# EAGLE board Educ-8 (EAGLE 6.6.0), part 1 of 4
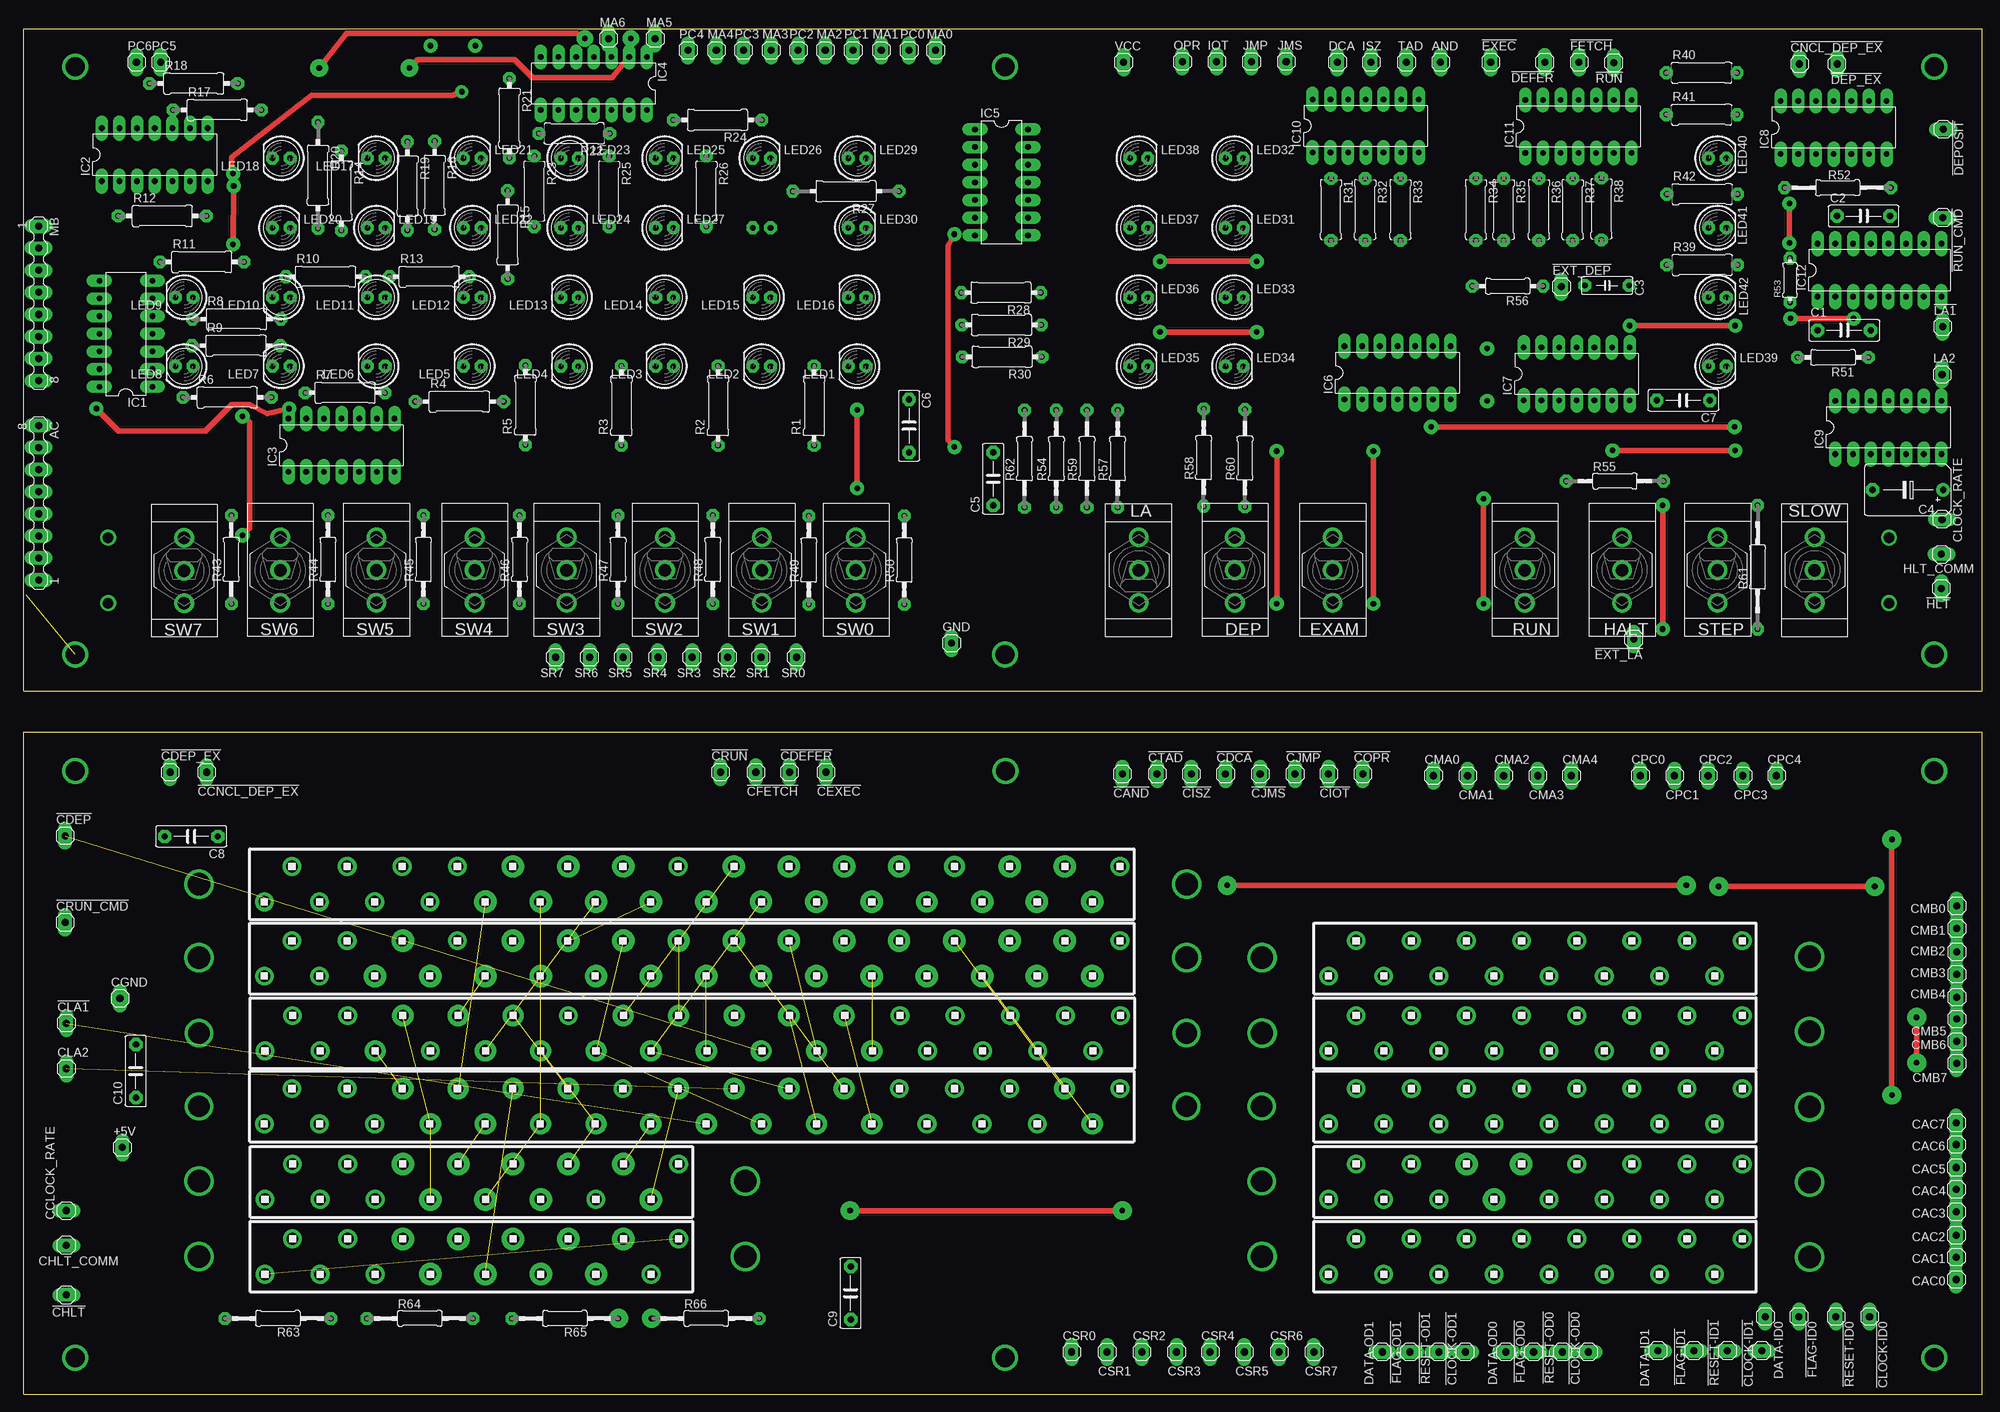
[diagram p3: board, top side]
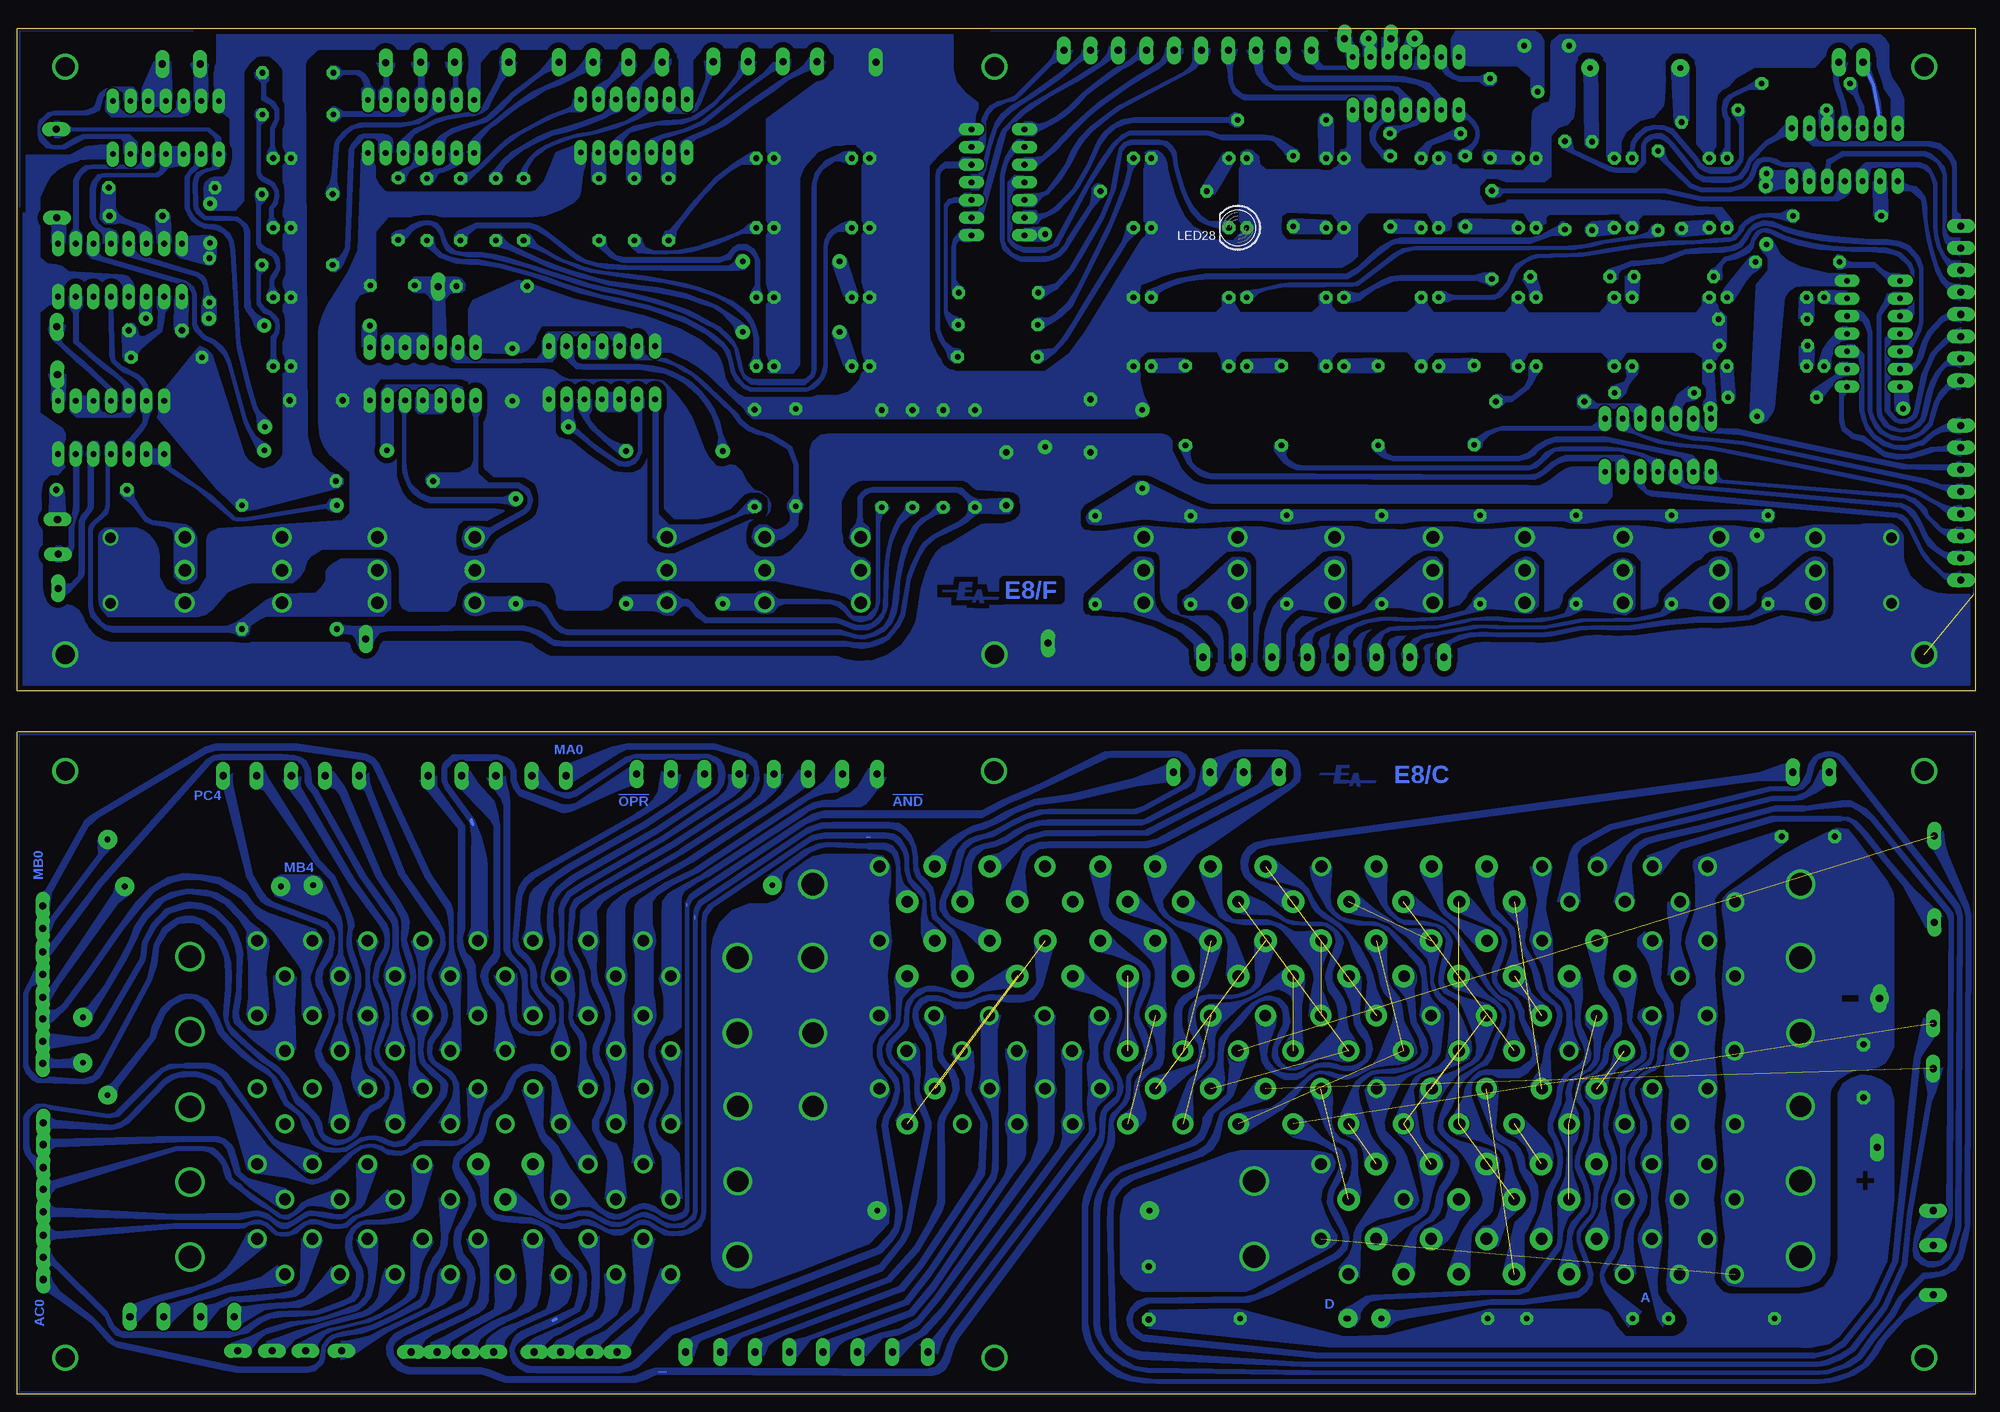
[diagram p4: board, bottom side, seen from below]

Size 281.35 x 196.26 mm. Coordinates in mm from the lower left corner, seen from the top.
Outline: 0,0 281.35,0 281.35,95.17 0,95.17 0,0
Outline: 0,0 0,0
Outline: 0,101.09 281.35,101.09 281.35,196.26 0,196.26 0,101.09
Copper layers (1*16): Top 0.035mm / dielectric 1.5mm / Bottom 0.035mm
Design rules "default *": minimum track width 3mil, minimum drill 32mil, track to track 8mil, track to pad 8mil, pad to pad 8mil, via to via 8mil, smd to smd 8mil, copper to edge 10mil, drill to drill 8mil, minimum pad ring 20mil, minimum via ring 8mil, stop-mask expansion 4mil, vias tented up to drill 0mil, thermal gap 10mil

## Footprints (pad centres in the part's own frame; a part is rotated, then mirrored left to right if it is on the bottom)
MA01-1 = drill 1.016 long: 1 0,0
MA08-1 = drill 1.016 long: 1 -12.7,0; 2 -9.525,0; 3 -6.35,0; 4 -3.175,0; 5 0,0; 6 3.175,0; 7 6.35,0; 8 9.525,0
C075-032X103 = drill 0.914 octagon: 1 -3.81,0; 2 3.81,0
C063-025X075 = drill 0.813 octagon: 1 -2.54,0; 2 3.81,0
B45181C = drill 0.914: + -5.08,0 | drill 0.914 octagon: - 5.08,0
7109 = drill 1.803: 1 0,4.699; 2 0,0; 3 0,-4.699
133-12-17 = drill 1.676: 1 -29.718,-2.54; 2 -25.756,2.54; 3 -21.793,-2.54; 4 -17.831,2.54; 5 -13.868,-2.54; 6 -9.906,2.54; 7 -5.944,-2.54; 8 -1.981,2.54; 9 1.981,-2.54; 10 5.944,2.54; 11 9.906,-2.54; 12 13.868,2.54; 13 17.831,-2.54; 14 21.793,2.54; 15 25.756,-2.54; 16 29.718,2.54
133-14-17 = drill 1.676: 1 -61.468,-2.54; 2 -57.506,2.54; 3 -53.543,-2.54; 4 -49.581,2.54; 5 -45.618,-2.54; 6 -41.656,2.54; 7 -37.694,-2.54; 8 -33.731,2.54; 9 -29.769,-2.54; 10 -25.806,2.54; 11 -21.844,-2.54; 12 -17.882,2.54; 13 -13.919,-2.54; 14 -9.957,2.54; 15 -5.994,-2.54; 16 -2.032,2.54; 17 2.032,-2.54; 18 5.994,2.54; 19 9.957,-2.54; 20 13.919,2.54; 21 17.882,-2.54; 22 21.844,2.54; 23 25.806,-2.54; 24 29.769,2.54; 25 33.731,-2.54; 26 37.694,2.54; 27 41.656,-2.54; 28 45.618,2.54; 29 49.581,-2.54; 30 53.543,2.54; 31 57.506,-2.54; 32 61.468,2.54
DIL14 = drill 0.813 long: 1 -7.62,-3.81; 2 -5.08,-3.81; 3 -2.54,-3.81; 4 0,-3.81; 5 2.54,-3.81; 6 5.08,-3.81; 7 7.62,-3.81; 8 7.62,3.81; 9 5.08,3.81; 10 2.54,3.81; 11 0,3.81; 12 -2.54,3.81; 13 -5.08,3.81; 14 -7.62,3.81
DIL16 = drill 0.813 long: 1 -8.89,-3.81; 2 -6.35,-3.81; 3 -3.81,-3.81; 4 -1.27,-3.81; 5 1.27,-3.81; 6 3.81,-3.81; 7 6.35,-3.81; 8 8.89,-3.81; 9 8.89,3.81; 10 6.35,3.81; 11 3.81,3.81; 12 1.27,3.81; 13 -1.27,3.81; 14 -3.81,3.81; 15 -6.35,3.81; 16 -8.89,3.81
LED5MM = drill 0.813 octagon: A -1.27,0; K 1.27,0
0309/.45 = drill 0.813 octagon: 1 -5.715,0; 2 5.715,0
0309/12 = drill 0.813 octagon: 1 -6.35,0; 2 6.35,0
0309/11 = drill 0.813 octagon: 1 -6.032,0; 2 6.032,0
0309/15 = drill 0.813 octagon: 1 -7.62,0; 2 7.62,0
0309/10 = drill 0.813 octagon: 1 -5.08,0; 2 5.08,0
0309/8 = drill 0.813 octagon: 1 -4.445,0; 2 4.445,0
0207/12 = drill 0.813 octagon: 1 -6.35,0; 2 6.35,0
0207/10 = drill 0.813 octagon: 1 -5.08,0; 2 5.08,0
0207/15 = drill 0.813 octagon: 1 -7.62,0; 2 7.62,0
0204/6 = drill 0.813 octagon: 1 -3.175,0; 2 3.175,0
0207/13 = drill 0.813 octagon: 1 -6.985,0; 2 6.985,0
0207/22 = drill 0.813 octagon: 1 -8.89,0; 2 8.89,0

## Placement (x,y rotation side)
!CAND  MA01-1  [MA01-1]  157.82,89.15 0 top
!CCNCL_DEP_EX  MA01-1  [MA01-1]  26.25,89.41 0 top
!CDCA  MA01-1  [MA01-1]  172.64,89.15 0 top
!CDEFER  MA01-1  [MA01-1]  109.98,89.41 0 top
!CDEP  MA01-1  [MA01-1]  5.93,80.26 0 top
!CDEP_EX  MA01-1  [MA01-1]  21,89.41 0 top
!CEXEC  MA01-1  [MA01-1]  115.23,89.41 0 top
!CFETCH  MA01-1  [MA01-1]  105.16,89.41 0 top
!CHLT  MA01-1  [MA01-1]  6.1,14.31 90 top
!CIOT  MA01-1  [MA01-1]  187.45,89.15 0 top
!CISZ  MA01-1  [MA01-1]  167.72,89.15 0 top
!CJMP  MA01-1  [MA01-1]  182.63,89.15 0 top
!CJMS  MA01-1  [MA01-1]  177.63,89.15 0 top
!CLA1  MA01-1  [MA01-1]  6.1,53.34 0 top
!CLOCK-ID0  MA01-1  [MA01-1]  265.18,11.18 0 top
!CLOCK-ID1  MA01-1  [MA01-1]  249.68,6.27 270 top
!CLOCK-OD0  MA01-1  [MA01-1]  224.79,6.1 270 top
!CLOCK-OD1  MA01-1  [MA01-1]  207.09,6.1 270 top
!CNCL_DEP_EX  MA01-1  [MA01-1]  255.1,191.18 0 top
!COPR  MA01-1  [MA01-1]  192.36,89.15 0 top
!CRUN  MA01-1  [MA01-1]  100.08,89.41 0 top
!CRUN_CMD  MA01-1  [MA01-1]  5.93,67.82 0 top
!CTAD  MA01-1  [MA01-1]  162.81,89.15 0 top
!DEFER  MA01-1  [MA01-1]  218.52,191.43 180 top
!DEP_EX  MA01-1  [MA01-1]  260.52,191.18 180 top
!DEPOSIT  MA01-1  [MA01-1]  275.76,181.78 270 top
!EXEC  MA01-1  [MA01-1]  210.74,191.43 0 top
!EXT_DEP  MA01-1  [MA01-1]  220.9,159.17 0 top
!EXT_LA  MA01-1  [MA01-1]  231.31,108.54 180 top
!FETCH  MA01-1  [MA01-1]  223.44,191.43 0 top
!FLAG-ID0  MA01-1  [MA01-1]  255.02,11.18 0 top
!FLAG-ID1  MA01-1  [MA01-1]  239.95,6.27 270 top
!FLAG-OD0  MA01-1  [MA01-1]  216.92,6.1 270 top
!FLAG-OD1  MA01-1  [MA01-1]  199.14,6.1 270 top
!HLT  MA01-1  [MA01-1]  275.51,115.82 180 top
!LA1  MA01-1  [MA01-1]  275.67,153.42 0 top
!RESET-ID0  MA01-1  [MA01-1]  260.35,11.18 0 top
!RESET-ID1  MA01-1  [MA01-1]  244.77,6.27 270 top
!RESET-OD0  MA01-1  [MA01-1]  221.06,6.1 270 top
!RESET-OD1  MA01-1  [MA01-1]  203.28,6.1 270 top
!RUN  MA01-1  [MA01-1]  228.43,191.35 180 top
!RUN_CMD  MA01-1  [MA01-1]  275.67,169.08 270 top
+5V  MA01-1  [MA01-1]  14.14,35.48 0 top
AC  AC  [MA08-1]  2.12,129.71 90 top
AND  MA01-1  [MA01-1]  203.54,191.43 0 top
C1  100pF  [C075-032X103]  261.54,152.91 0 top
C2  1nF  [C075-032X103]  264.33,169.33 0 top
C3  0.1uF  [C063-025X075]  226.82,159.34 0 top
C4  47uF  [B45181C]  270.68,129.96 180 top
C5  0.1uF  [C075-032X103]  139.28,131.57 90 top
C6  0.1uF  [C075-032X103]  127.17,139.19 270 top
C7  0.047uF  [C075-032X103]  238.42,142.83 180 top
C8  0.1uF  [C075-032X103]  24.05,80.18 180 top
C9  0.1uF  [C075-032X103]  118.79,14.56 90 top
C10  0.1uF  [C075-032X103]  16.09,46.48 90 top
CAC0  MA01-1  [MA01-1]  277.62,16.51 0 top
CAC1  MA01-1  [MA01-1]  277.62,19.73 0 top
CAC2  MA01-1  [MA01-1]  277.62,22.86 0 top
CAC3  MA01-1  [MA01-1]  277.62,26.25 0 top
CAC4  MA01-1  [MA01-1]  277.62,29.46 0 top
CAC5  MA01-1  [MA01-1]  277.62,32.6 0 top
CAC6  MA01-1  [MA01-1]  277.62,35.9 0 top
CAC7  MA01-1  [MA01-1]  277.62,39.03 0 top
CCLOCK_RATE  MA01-1  [MA01-1]  6.1,26.42 90 top
CGND  MA01-1  [MA01-1]  13.8,56.9 0 top
CHLT_COMM  MA01-1  [MA01-1]  6.1,21.42 270 top
CLA2  MA01-1  [MA01-1]  6.1,46.82 0 top
CLOCK_RATE  MA01-1  [MA01-1]  275.59,125.73 270 top
CMA0  MA01-1  [MA01-1]  202.52,88.9 0 top
CMA1  MA01-1  [MA01-1]  207.43,88.9 0 top
CMA2  MA01-1  [MA01-1]  212.6,88.9 0 top
CMA3  MA01-1  [MA01-1]  217.51,88.9 0 top
CMA4  MA01-1  [MA01-1]  222.33,88.9 0 top
CMB0  MA01-1  [MA01-1]  277.71,70.19 0 top
CMB1  MA01-1  [MA01-1]  277.71,66.97 0 top
CMB2  MA01-1  [MA01-1]  277.71,63.58 0 top
CMB3  MA01-1  [MA01-1]  277.71,60.37 0 top
CMB4  MA01-1  [MA01-1]  277.71,57.07 0 top
CMB5  MA01-1  [MA01-1]  277.71,53.93 0 top
CMB6  MA01-1  [MA01-1]  277.71,50.72 0 top
CMB7  MA01-1  [MA01-1]  277.71,47.58 0 top
CPC0  MA01-1  [MA01-1]  232.24,88.9 0 top
CPC1  MA01-1  [MA01-1]  237.15,88.9 0 top
CPC2  MA01-1  [MA01-1]  241.98,88.9 0 top
CPC3  MA01-1  [MA01-1]  246.97,88.9 0 top
CPC4  MA01-1  [MA01-1]  251.8,88.9 0 top
CSR0  MA01-1  [MA01-1]  150.54,6.1 0 top
CSR1  MA01-1  [MA01-1]  155.62,6.1 0 top
CSR2  MA01-1  [MA01-1]  160.61,6.1 0 top
CSR3  MA01-1  [MA01-1]  165.61,6.1 0 top
CSR4  MA01-1  [MA01-1]  170.43,6.1 0 top
CSR5  MA01-1  [MA01-1]  175.34,6.1 0 top
CSR6  MA01-1  [MA01-1]  180.34,6.1 0 top
CSR7  MA01-1  [MA01-1]  185.34,6.1 0 top
DATA-ID0  MA01-1  [MA01-1]  250.19,11.18 0 top
DATA-ID1  MA01-1  [MA01-1]  234.78,6.27 270 top
DATA-OD0  MA01-1  [MA01-1]  212.94,6.1 270 top
DATA-OD1  MA01-1  [MA01-1]  195.16,6.1 270 top
DCA  MA01-1  [MA01-1]  188.72,191.43 0 top
DEP  710X  [7109]  173.99,118.45 180 top
E8/10T  MCMURDO-16  [133-12-17]  64.35,19.81 0 top
E8/10T-2  MCMURDO-16  [133-12-17]  217.17,19.81 0 top
E8/A  MCMURDO-16  [133-12-17]  64.35,30.56 0 top
E8/A-2  MCMURDO-16  [133-12-17]  217.17,30.56 0 top
E8/D  MCMURDO-32  [133-14-17]  96.01,62.65 0 top
E8/D-2  MCMURDO-16  [133-12-17]  217.17,62.65 0 top
E8/M  MCMURDO-32  [133-14-17]  96.1,51.9 0 top
E8/M-2  MCMURDO-16  [133-12-17]  217.17,51.9 0 top
E8/P  MCMURDO-32  [133-14-17]  96.01,41.4 0 top
E8/P-2  MCMURDO-16  [133-12-17]  217.17,41.4 0 top
E8/T  MCMURDO-32  [133-14-17]  96.01,73.32 0 top
EXAM  710X  [7109]  188.04,118.45 180 top
GND  MA01-1  [MA01-1]  133.27,107.95 0 top
HALT  710X  [7109]  229.62,118.45 180 top
HLT_COMM  MA01-1  [MA01-1]  275.51,120.73 90 top
IC1  7405N  [DIL14]  14.65,152.4 90 top
IC2  7405N  [DIL14]  18.8,178.14 0 top
IC3  7405N  [DIL14]  45.64,136.4 0 top
IC4  7405N  [DIL14]  81.87,188.38 180 top
IC5  7405N  [DIL14]  140.46,174.16 270 top
IC6  7400N  [DIL14]  197.36,146.81 0 top
IC7  7400N  [DIL14]  223.1,146.64 0 top
IC8  7400N  [DIL14]  260.01,182.03 0 top
IC9  7400N  [DIL14]  267.89,138.94 0 top
IC10  7417N  [DIL14]  192.79,182.29 0 top
IC11  7417N  [DIL14]  223.35,182.2 0 top
IC12  DM9602N  [DIL16]  266.62,161.54 0 top
IOT  MA01-1  [MA01-1]  171.37,191.52 0 top
ISZ  MA01-1  [MA01-1]  193.55,191.43 0 top
JMP  MA01-1  [MA01-1]  176.36,191.52 0 top
JMS  MA01-1  [MA01-1]  181.36,191.52 0 top
LA  710X  [7109]  160.19,118.45 0 top
LA2  MA01-1  [MA01-1]  275.59,146.56 0 top
LED1  [LED5MM]  119.72,147.74 180 top
LED2  [LED5MM]  106,147.74 180 top
LED3  [LED5MM]  92.03,147.74 180 top
LED4  [LED5MM]  78.4,147.74 180 top
LED5  [LED5MM]  64.43,147.74 180 top
LED6  [LED5MM]  50.63,147.74 180 top
LED7  [LED5MM]  37,147.74 180 top
LED8  [LED5MM]  23.03,147.74 180 top
LED9  [LED5MM]  23.03,157.65 180 top
LED10  [LED5MM]  37,157.65 180 top
LED11  [LED5MM]  50.63,157.65 180 top
LED12  [LED5MM]  64.43,157.65 180 top
LED13  [LED5MM]  78.4,157.65 180 top
LED14  [LED5MM]  92.03,157.65 180 top
LED15  [LED5MM]  106,157.65 180 top
LED16  [LED5MM]  119.72,157.65 180 top
LED17  [LED5MM]  50.63,177.63 180 top
LED18  [LED5MM]  37,177.63 180 top
LED19  [LED5MM]  50.63,167.64 0 top
LED20  [LED5MM]  37,167.64 0 top
LED21  [LED5MM]  64.43,177.63 0 top
LED22  [LED5MM]  64.43,167.64 0 top
LED23  [LED5MM]  78.4,177.63 0 top
LED24  [LED5MM]  78.4,167.64 0 top
LED25  [LED5MM]  92.03,177.63 0 top
LED26  [LED5MM]  106,177.63 0 top
LED27  [LED5MM]  92.03,167.64 0 top
LED28  [LED5MM]  106,167.64 180 bottom
LED29  [LED5MM]  119.72,177.63 0 top
LED30  [LED5MM]  119.72,167.64 0 top
LED31  [LED5MM]  173.91,167.64 0 top
LED32  [LED5MM]  173.91,177.63 0 top
LED33  [LED5MM]  173.91,157.65 0 top
LED34  [LED5MM]  173.91,147.74 0 top
LED35  [LED5MM]  160.19,147.74 0 top
LED36  [LED5MM]  160.19,157.65 0 top
LED37  [LED5MM]  160.19,167.64 0 top
LED38  [LED5MM]  160.19,177.63 0 top
LED39  [LED5MM]  243.33,147.74 0 top
LED40  [LED5MM]  243.33,177.63 0 top
LED41  [LED5MM]  243.33,167.64 0 top
LED42  [LED5MM]  243.33,157.65 0 top
MA0  MA01-1  [MA01-1]  130.98,193.12 0 top
MA1  MA01-1  [MA01-1]  123.19,193.12 0 top
MA2  MA01-1  [MA01-1]  115.15,193.12 0 top
MA3  MA01-1  [MA01-1]  107.36,193.12 0 top
MA4  MA01-1  [MA01-1]  99.48,193.12 0 top
MA5  MA01-1  [MA01-1]  90.68,194.82 0 top
MA6  MA01-1  [MA01-1]  83.99,194.82 0 top
MB  MB  [MA08-1]  2.12,155.19 270 top
OPR  MA01-1  [MA01-1]  166.45,191.52 0 top
PC0  MA01-1  [MA01-1]  127.17,193.12 0 top
PC1  MA01-1  [MA01-1]  119.13,193.12 0 top
PC2  MA01-1  [MA01-1]  111.25,193.12 0 top
PC3  MA01-1  [MA01-1]  103.38,193.12 0 top
PC4  MA01-1  [MA01-1]  95.42,193.12 0 top
PC5  MA01-1  [MA01-1]  19.64,191.43 0 top
PC6  MA01-1  [MA01-1]  16.17,191.43 0 top
R1  180 1/2W  [0309/.45]  113.54,142.07 90 top
R2  180 1/2W  [0309/.45]  99.74,142.07 90 top
R3  180 1/2W  [0309/.45]  85.85,142.07 90 top
R4  180 1/2W  [0309/12]  62.57,142.66 0 top
R5  180 1/2W  [0309/.45]  72.05,142.16 90 top
R6  180 1/2W  [0309/12]  29.21,143.26 0 top
R7  180 1/2W  [0309/.45]  46.14,143.93 0 top
R8  180 1/2W  [0309/12]  30.56,154.52 0 top
R9  180 1/2W  [0309/12]  30.48,150.71 0 top
R10  180 1/2W  [0309/.45]  43.35,160.61 0 top
R11  180 1/2W  [0309/11]  25.57,162.73 0 top
R12  180 1/2W  [0309/12]  19.9,169.33 0 top
R13  180 1/2W  [0309/.45]  58.25,160.61 0 top
R14  180 1/2W  [0309/.45]  45.64,172.97 270 top
R15  180 1/2W  [0309/12]  69.51,166.62 270 top
R16  180 1/2W  [0309/12]  59.01,173.74 270 top
R17  180 1/2W  [0309/12]  27.77,184.57 0 top
R18  180 1/2W  [0309/12]  24.38,188.38 0 top
R19  180 1/2W  [0309/12]  55.12,173.65 270 top
R20  180 1/2W  [0309/15]  42.25,175.18 270 top
R21  180 1/2W  [0309/.45]  69.77,183.39 270 top
R22  180 1/2W  [0309/10]  79.08,181.19 180 top
R23  180 1/2W  [0309/10]  73.32,172.89 270 top
R24  180 1/2W  [0309/12]  99.65,183.13 180 top
R25  180 1/2W  [0309/10]  84.07,172.89 270 top
R26  180 1/2W  [0309/10]  98.04,172.89 270 top
R27  180 1/2W  [0309/15]  118.11,172.89 180 top
R28  180 1/2W  [0309/.45]  140.38,158.33 180 top
R29  180 1/2W  [0309/.45]  140.46,153.67 180 top
R30  180 1/2W  [0309/.45]  140.55,149.1 180 top
R31  180 1/2W  [0309/8]  187.79,170.26 270 top
R32  180 1/2W  [0309/8]  192.7,170.26 270 top
R33  180 1/2W  [0309/8]  197.78,170.26 270 top
R34  180 1/2W  [0309/8]  208.62,170.26 270 top
R35  180 1/2W  [0309/8]  212.6,170.26 270 top
R36  180 1/2W  [0309/8]  217.68,170.26 270 top
R37  180 1/2W  [0309/8]  222.5,170.26 270 top
R38  180 1/2W  [0309/8]  226.65,170.35 270 top
R39  180 1/2W  [0309/10]  241.13,162.31 0 top
R40  180 1/2W  [0309/10]  241.05,189.91 0 top
R41  180 1/2W  [0309/10]  241.05,183.9 0 top
R42  180 1/2W  [0309/10]  241.13,172.47 0 top
R43  10K  [0207/12]  29.8,119.97 90 top
R44  10K  [0207/12]  43.69,119.97 90 top
R45  10K  [0207/12]  57.4,119.97 90 top
R46  10K  [0207/12]  71.2,119.97 90 top
R47  10K  [0207/12]  85.34,119.97 90 top
R48  10K  [0207/12]  98.98,119.97 90 top
R49  10K  [0207/12]  112.78,119.89 90 top
R50  10K  [0207/12]  126.49,119.89 90 top
R51  10K  [0207/10]  259.93,149.01 180 top
R52  10K  [0207/15]  260.6,173.4 180 top
R53  1K  [0204/6]  253.75,160.1 90 top
R54  10K  [0207/13]  148.34,134.45 90 top
R55  10K  [0207/13]  228.6,131.23 0 top
R56  22K  [0207/10]  213.19,159.26 180 top
R57  10K  [0207/13]  157.14,134.45 90 top
R58  10K  [0207/13]  169.5,134.62 90 top
R59  10K  [0207/13]  152.74,134.45 90 top
R60  10K  [0207/13]  175.43,134.54 90 top
R61  10K  [0207/22]  249.09,118.87 90 top
R62  22K  [0207/13]  143.76,134.45 90 top
R63  680  [0207/15]  36.49,10.92 180 top
R64  680  [0207/15]  56.9,10.92 0 top
R65  4700  [0207/15]  77.72,10.92 180 top
R66  4700  [0207/15]  98.04,10.92 0 top
RUN  710X  [7109]  215.65,118.45 180 top
SLOW  710X  [7109]  257.3,118.45 0 top
SR0  MA01-1  [MA01-1]  111,105.92 180 top
SR1  MA01-1  [MA01-1]  105.92,105.92 180 top
SR2  MA01-1  [MA01-1]  101.09,105.92 180 top
SR3  MA01-1  [MA01-1]  96.01,105.92 180 top
SR4  MA01-1  [MA01-1]  91.1,105.92 180 top
SR5  MA01-1  [MA01-1]  86.11,105.92 180 top
SR6  MA01-1  [MA01-1]  81.28,105.92 180 top
SR7  MA01-1  [MA01-1]  76.37,105.92 180 top
STEP  710X  [7109]  243.33,118.45 180 top
SW0  710X  [7109]  119.55,118.45 180 top
SW1  710X  [7109]  106,118.45 180 top
SW2  710X  [7109]  92.12,118.45 180 top
SW3  710X  [7109]  77.98,118.45 180 top
SW4  710X  [7109]  64.77,118.45 180 top
SW5  710X  [7109]  50.63,118.45 180 top
SW6  710X  [7109]  36.83,118.45 180 top
SW7  710X  [7109]  23.03,118.36 180 top
TAD  MA01-1  [MA01-1]  198.63,191.43 0 top
VCC  MA01-1  [MA01-1]  157.99,191.43 0 top

## Tracks (layer width: path | path; a pad name or v marks a point on that pad's centre or on a via)
!CAND
  pour Bottom (no thermals): 182.12,74.34 168.49,83.23 167.56,83.9 166.37,84.33 165.44,84.5 160.1,84.5 159.43,84.84 156.46,88.56 159.09,89.92 160.61,87.29 161.63,86.44 163.75,85.43 165.52,85.34 167.13,85.01 168.99,83.9 182.88,74.76
  pour Bottom (no thermals): 188.98,28.19 188.81,29.29 188.64,30.65 188.64,33.1 188.72,34.21 189.4,35.22 189.99,36.41 190.42,37.68 190.58,38.61 190.42,39.62 189.31,42.25 188.89,43.52 188.81,44.37 188.81,45.04 189.4,46.14 190.33,47.92 190.58,48.51 190.58,49.36 190.42,50.12 189.57,51.73 189.06,52.92 188.47,54.19 188.47,56.98 188.72,58.42 189.15,59.69 188.72,60.88 188.72,68.66 188.64,70.87 187.88,71.88 186.94,72.56 182.88,74.76 182.12,74.34 183.98,73.32 185.59,72.31 186.01,71.46 186.01,52.75 186.61,52.15 187.45,51.65 188.38,51.48 189.74,50.12 189.82,49.02 189.57,48.09 188.13,45.21 187.88,44.2 187.96,43.1 189.65,39.62 189.74,38.61 189.4,37.34 188.55,36.58 187.54,35.98 186.27,34.63 185.84,28.11
!CCNCL_DEP_EX  (via drill 0.81 pad 3.22)
  other vias: 98.04,70.78
  pour Bottom (no thermals): 98.64,69.26 104.14,73.41 105.07,74.34 105.49,75.52 105.58,76.62 105.24,77.64 104.56,78.66 103.63,79.33 101.85,79.76 33.7,88.98 30.99,89.41 27.77,90.59 26.33,90.85 26.67,88.05 30.9,88.14 34.04,87.8 101.43,78.82 103.29,78.32 104.31,77.39 104.65,76.12 104.39,75.01 103.63,74.17 103.04,73.83 97.96,72.39
!CDCA
  pour Bottom (no thermals): 185.76,77.64 173.99,85.17 172.47,86.61 171.53,87.71 171.28,89.07 174.07,89.15 174.07,87.71 174.67,86.19 176.02,84.92 186.27,78.23
  pour Bottom (no thermals): 196.93,28.02 196.51,32.17 196.51,33.53 196.77,34.46 197.53,35.73 198.2,37 198.71,38.1 198.71,39.37 198.2,40.39 197.36,42.33 196.93,43.86 197.02,45.13 197.53,46.23 198.2,47.16 198.54,48.18 198.63,49.53 198.54,50.12 197.53,52.41 196.85,54.02 196.93,55.03 197.27,55.88 197.87,57.15 198.54,58.59 198.88,59.52 198.88,60.79 199.05,61.38 199.47,62.48 200.07,63.5 200.83,65.53 200.49,66.97 200.32,69.6 197.7,71.71 186.27,78.23 185.76,77.64 195.41,72.05 197.27,70.78 198.2,69.43 198.04,66.97 197.78,65.02 198.12,63.5 198.2,60.88 197.95,59.18 197.19,57.83 196.43,56.05 196.09,54.69 196.26,53.59 196.93,51.65 197.78,49.95 197.87,48.77 197.36,47.58 196.51,46.14 196.26,44.87 196.17,43.43 196.43,42.33 196.85,41.4 197.87,39.54 197.87,38.1 197.44,37.25 196.77,36.58 195.92,36.32 195.33,36.07 194.9,35.22 194.48,34.21 193.8,28.19
!CDEFER  (via drill 0.81 pad 3.05, 0.81 pad 3.22)  (1 unrouted)
  other vias: 145.54,70.78 113.88,49.36 117.86,75.86 109.9,65.19
  pour Bottom (no thermals): 98.3,87.04 97.11,88.14 96.94,89.07 97.11,90.34 97.37,91.27 98.13,92.03 98.89,92.54 100.08,92.63 105.75,92.63 106.76,92.37 110.49,90.93 111.25,90.17 111.51,88.73 111.84,87.29 112.1,86.61 111,86.19 108.88,88.05 108.03,89.66 107.27,90.85 106.51,91.36 105.41,91.69 99.82,91.69 98.98,91.36 98.21,90.68 97.96,90 97.96,88.56 98.38,87.97 98.64,87.71
  pour Bottom (no thermals): 112.78,50.38 113.71,51.9 114.05,53.17 114.05,55.12 113.71,55.96 112.95,56.73 111.84,57.57 110.83,58.5 110.24,59.18 108.37,64.18 108.37,65.36 109.81,66.89 112.18,67.56 114.72,68.07 115.82,68.75 116.67,69.93 116.76,71.12 111.93,77.64 109.98,78.91 98.3,87.04 98.64,87.71 118.7,77.22 119.21,76.71 119.55,76.12 119.38,75.27 118.03,71.04 117.43,69.6 116.67,68.66 115.99,68.16 115.15,67.56 113.79,66.8 112.78,66.29 111.93,65.53 111.68,65.11 111.34,64.35 111.42,59.61 111.76,58.76 112.52,58 113.88,57.23 114.64,56.56 115.06,55.71 115.15,54.69 115.15,51.56 115.49,49.61
  pour Bottom (no thermals): 146.98,71.63 146.39,72.31 145.46,74.85 145.03,76.96 144.44,78.23 143.59,78.74 142.75,79.08 140.89,79.5 139.19,80.35 137.92,81.2 136.4,81.96 134.79,82.47 133.43,82.63 119.55,82.63 112.1,86.61 111,86.19 118.79,82.13 119.8,81.79 134.2,81.79 135.64,81.36 136.91,80.86 139.36,79.25 140.8,78.66 142.58,78.32 143.68,77.39 144.19,76.45 144.36,75.35 144.1,70.61
!CDEP  (via drill 0.81 pad 3.05)  (1 unrouted)
  other vias: 105.92,49.36
  pour Bottom (no thermals): 104.39,49.11 106.76,42.84 107.36,42.16 109.56,40.3 109.9,39.2 110.57,37.34 111,36.58 112.27,35.73 122.68,32 123.7,31.24 124.54,30.31 125.31,29.13 125.73,27.43 125.9,25.99 125.9,10.08 125.56,8.55 124.8,7.11 123.78,6.01 122.68,5.16 120.9,4.15 119.04,3.81 95.59,3.47 22.44,3.39 22.44,2.79 99.31,2.79 118.96,3.13 120.82,3.47 122.43,4.06 123.61,4.91 124.88,6.01 125.9,7.54 126.41,8.47 126.66,9.91 126.66,26.59 126.49,27.94 126.07,29.21 125.22,30.65 124.38,31.75 122.85,32.77 112.78,36.41 111.84,37.17 111.34,37.85 111,39.03 111,39.71 110.32,40.72 107.53,43.18 107.44,43.94 107.1,47.33 107.61,49.19
  pour Bottom (no thermals): 22.44,3.39 21.34,3.56 18.88,4.4 16.93,5.67 14.9,8.55 13.38,10.33 12.28,11.77 11.01,13.97 7.54,17.44 6.52,17.53 5.16,17.7 3.98,18.2 3.13,19.22 2.46,20.32 2.03,22.18 1.44,24.38 1.52,24.89 1.35,68.66 1.61,69.85 5.16,76.71 6.01,78.23 7.2,79.5 4.66,80.94 4.4,79.08 3.98,77.55 1.02,70.27 0.68,68.75 0.85,24.38 1.19,22.27 1.95,19.47 2.96,17.86 4.49,17.02 6.27,16.68 7.45,16.51 8.21,15.75 10.58,13.29 11.51,11.35 14.65,7.62 15.92,5.76 16.59,5 18.2,3.89 19.81,3.39 21.25,2.88 22.44,2.79
!CDEP_EX
  pour Bottom (no thermals): 55.37,77.13 50.38,80.26 48.6,81.28 39.45,83.48 29.38,86.02 25.91,86.02 24.3,86.61 23.37,87.55 22.27,89.83 20.07,88.39 23.03,86.36 24.89,85.43 26.59,85.17 29.13,85.26 39.45,82.55 48.26,80.52 49.61,79.59 50.63,78.49 53,75.18
!CEXEC  (via drill 0.81 pad 3.22)
  other vias: 149.52,75.86
  pour Bottom (no thermals): 148.17,75.27 146.9,78.49 146.13,79.42 144.86,80.43 143.68,80.94 142.49,81.28 140.8,81.96 139.53,82.63 138.01,83.57 135.13,84.67 129.29,85.43 120.65,87.46 114.98,88.14 115.74,90.68 120.9,88.48 130.05,86.19 135.3,85.51 137.67,84.5 139.28,83.74 141.48,82.55 142.83,82.04 144.02,81.7 145.88,80.77 147.4,79.76 150.79,76.96
!CFETCH  (via drill 0.81 pad 3.22)
  other vias: 141.65,75.86
  pour Bottom (no thermals): 142.49,77.3 140.21,77.89 137.33,79.67 136.06,80.43 134.79,80.77 133.77,81.03 119.46,81.03 108.03,86.87 107.1,86.36 118.87,80.35 133.77,80.18 135.38,79.76 136.65,79.16 140.38,74.85
  pour Bottom (no thermals): 107.1,86.36 104.9,87.46 103.89,88.9 106.51,90 107.27,88.14 108.03,86.87
!CHLT  (via drill 0.81 pad 3.22)
  other vias: 125.73,65.19
  pour Bottom (no thermals): 22.27,2.2 20.74,2.37 18.2,3.22 16.17,4.4 14.82,6.18 13.97,7.62 12.36,9.57 10.5,11.51 9.14,13.21 7.2,15.32 5.33,13.12 10.41,10.58 12.02,8.81 13.04,7.62 14.14,5.76 15.49,4.06 17.61,2.71 19.73,1.86 20.91,1.69 22.44,1.52
  pour Bottom (no thermals): 124.8,66.46 123.27,64.77 121.92,63.58 119.97,62.31 119.3,61.64 118.62,60.71 118.7,58.84 118.96,57.91 119.46,56.81 120.14,55.37 120.31,54.61 119.97,53.68 119.38,52.49 118.7,50.97 118.36,49.78 118.36,48.77 118.79,48.09 119.72,47.16 120.99,46.14 121.41,45.3 121.41,43.94 121.58,42.59 122,41.66 122.85,40.81 123.53,40.05 123.95,39.03 123.87,38.44 123.7,37.68 123.7,36.49 123.87,35.64 126.92,29.21 127.25,28.11 127.59,26.92 127.59,10.33 127.42,9.23 127,7.7 126.32,6.35 125.39,5.25 123.87,3.89 122.68,3.22 121.16,2.62 119.63,2.37 117.86,2.2 22.27,2.2 22.44,1.52 117.86,1.52 119.63,1.61 121.58,1.86 123.27,2.46 124.8,3.47 125.98,4.66 127.25,6.27 127.93,7.96 128.35,9.4 128.35,27.09 128.1,28.45 127.59,29.8 124.71,36.15 124.54,38.1 124.46,39.45 124.12,40.3 123.44,40.98 122.6,41.99 122.26,42.5 122,43.43 122,44.62 121.92,45.72 121.67,46.14 121.24,46.65 119.89,47.84 119.38,48.77 119.38,49.45 119.55,50.38 120.65,53.09 120.82,54.1 120.73,55.29 120.57,56.22 119.63,58.67 119.55,59.69 119.72,60.71 120.23,61.55 120.9,61.98 124.12,63.16 126.24,63.58 127.08,64.26
!CIOT
  pour Bottom (no thermals): 192.02,82.8 188.04,85.34 186.52,86.78 186.01,88.98 188.89,89.49 189.4,86.53 189.99,85.43 191.09,84.33 192.62,83.4
  pour Bottom (no thermals): 209.63,60.54 209.55,59.27 209.72,55.46 209.63,53.68 208.96,52.92 207.94,52.24 206.42,52.15 205.66,52.41 205.06,53.09 204.81,54.02 204.81,54.95 205.15,55.71 206.16,56.64 206.84,57.49 207.43,58.5 207.52,59.27 207.52,60.54 207.77,61.47 208.36,62.31 209.38,63.25 209.97,64.09 210.14,65.11 209.63,71.46 209.3,72.9 208.45,74.17 207.43,75.01 192.62,83.4 192.02,82.8 207.09,74.17 208.11,73.24 208.62,72.31 208.87,71.46 209.47,65.28 209.21,64.18 207.94,62.99 207.09,61.81 206.76,60.45 206.84,59.18 206.5,58.25 205.82,57.23 204.3,55.8 204.13,54.95 204.05,53.59 204.47,52.66 205.4,51.82 206.33,51.48 207.94,51.56 209.13,51.99 210.14,52.92 210.4,53.68 210.82,56.3 211.41,57.66 212.43,58.93 212.85,60.2
!CISZ
  pour Bottom (no thermals): 184.91,77.13 172.89,85.01 171.45,86.28 169.93,88.48 169.08,89.83 166.88,88.14 169.59,86.11 184.49,76.37
  pour Bottom (no thermals): 196.93,39.12 195.75,42.5 195.41,43.6 195.33,44.79 195.66,45.97 196.77,48.77 196.77,50.12 195.33,53.76 195.33,54.69 195.41,55.54 195.92,57.23 196.51,58.67 196.93,60.11 196.6,61.47 196.6,69 196.51,69.77 195.75,70.7 194.23,71.88 184.91,77.13 184.49,76.37 190.33,73.07 193.38,71.29 193.89,70.53 194.14,69.68 194.14,62.48 194.06,61.55 193.72,60.28 193.89,59.01 194.23,57.23 194.23,51.48 193.89,49.78 193.8,48.6 194.06,45.64 194.31,43.52 193.97,41.91 193.8,38.78
!CJMP
  pour Bottom (no thermals): 191.6,82.13 187.2,85.09 185.17,86.7 183.9,89.83 181.53,88.48 182.54,87.04 190.75,81.7
  pour Bottom (no thermals): 205.74,65.45 206.25,67.99 206.16,69.85 205.57,71.63 204.89,72.9 203.79,74 201.59,75.52 190.75,81.7 191.6,82.13 202.44,76.03 205.99,73.66 207.18,72.64 207.77,71.8 207.94,70.36 208.28,67.73 208.36,66.89 208.87,65.45
!CJMS
  pour Bottom (no thermals): 188.81,80.18 180.68,85.68 179.41,86.95 179.07,87.97 179.15,89.07 176.28,89.07 176.53,88.05 177.21,87.04 178.39,86.02 188.38,79.59
  pour Bottom (no thermals): 197.78,44.37 199.39,47.58 199.64,48.51 199.56,50.55 199.98,51.73 201.25,53.17 201.59,54.1 201.25,57.32 201.34,59.1 201.85,61.21 202.78,63.16 202.78,69.77 202.35,70.61 201.76,71.63 199.64,73.07 188.38,79.59 188.81,80.18 200.32,73.49 202.35,72.22 203.28,70.7 203.62,69.77 203.45,66.21 203.45,64.69 203.71,62.99 204.64,60.96 203.88,58.67 202.27,56.98 202.1,55.96 202.18,54.1 201.93,53.09 201.25,52.07 200.66,51.05 200.49,49.95 200.49,47.84 200.91,44.11
!CLA1  (via drill 0.81 pad 3.05)  (1 unrouted)
  other vias: 98.04,38.86
  pour Bottom (no thermals): 23.2,5.93 94.15,5.93 119.63,8.55 120.82,9.48 121.16,10.75 120.9,11.77 119.97,12.62 118.87,13.12 105.66,13.21 104.39,13.21 101.09,14.48 91.44,19.73 90.25,20.91 90,22.52 90.34,23.79 91.1,25.4 92.2,27.26 92.37,28.11 91.95,29.55 91.02,30.99 90.42,32.85 90.68,34.12 91.1,35.14 93.64,36.75 94.23,37.25 96.86,39.88 98.98,37.59 98.04,36.91 94.91,36.32 93.56,35.73 92.12,34.88 91.44,34.04 91.27,33.1 91.78,31.75 92.88,29.38 93.13,28.62 93.22,27.43 92.79,26.33 91.19,23.45 90.93,22.61 91.02,21.34 91.61,20.74 92.29,20.15 103.55,14.31 104.99,14.05 119.3,13.8 120.48,13.38 121.5,12.28 122,11.09 121.92,9.99 121.41,8.97 120.48,8.13 119.55,7.62 95,5.25 23.03,5.25
  pour Bottom (no thermals): 23.2,5.93 21.84,6.18 20.57,6.69 19.05,7.79 14.56,13.46 11.94,19.22 11.18,26.59 8.81,48.34 7.45,54.1 5.08,52.58 7.96,48.43 11.18,19.13 14.05,12.87 18.88,6.86 20.74,5.76 23.03,5.25
!CLOCK-ID0
  pour Bottom (no thermals): 256.46,15.41 261.11,14.14 263.31,13.46 265.94,12.45 264.08,10.41 261.7,12.95 260.6,13.46 256.2,14.65
  pour Bottom (no thermals): 245.53,21.51 248.41,19.13 250.61,17.36 252.31,16.17 253.32,15.75 254.76,15.24 256.2,14.65 256.46,15.41 254.25,16.17 252.56,17.02 251.21,18.2 250.02,19.81 248.24,23.2
!CLOCK-ID1
  pour Bottom (no thermals): 234.02,11.6 238.42,10.33 240.2,10.08 241.64,9.82 245.79,8.55 246.72,7.79 248.58,5.42 250.53,7.45 247.65,8.47 245.62,9.48 243.67,10.08 242.06,10.5 240.37,10.67 239.01,10.84 237.32,11.26 234.27,12.28
  pour Bottom (no thermals): 232.66,22.18 232.33,21.17 231.73,19.64 231.06,18.12 230.89,17.02 231.06,15.66 231.48,14.05 232.49,12.95 234.27,12.28 234.02,11.6 232.49,12.11 231.31,13.04 230.46,14.14 229.95,16.26 229.62,19.13 229.53,22.44
!CLOCK-OD0
  pour Bottom (no thermals): 213.61,22.35 213.61,15.75 213.7,13.38 214.21,12.36 215.22,11.6 221.83,8.47 222.5,9.23 217,11.77 215.56,12.78 215.05,13.63 214.71,16.17 214.8,17.95 215.39,19.39 216.32,20.74 216.83,22.35
  pour Bottom (no thermals): 222.5,9.23 225.38,7.79 226.06,6.94 223.52,5.59 223.27,6.94 222.67,7.96 221.83,8.47
!CLOCK-OD1
  pour Bottom (no thermals): 203.71,9.57 207.09,8.04 208.36,7.11 205.91,5.5 205.49,7.28 204.3,8.38 203.37,8.72 203.2,8.81 203.62,9.57
  pour Bottom (no thermals): 197.78,22.78 197.78,15.49 198.12,12.45 198.88,11.18 203.2,8.81 203.62,9.57 199.81,11.6 199.14,12.53 198.88,14.39 198.71,16.93 198.97,18.54 200.24,20.57 200.74,21.59
!CNCL_DEP_EX
  pour Bottom (no thermals): 255.95,185.76 255.95,189.82 256.12,190.33 256.46,191.01 256.46,191.18 255.19,192.45 253.83,191.09 254.08,190.42 253.92,186.18 254.08,185.59
!COPR
  Bottom 0.406: 215.9,81.87 216.15,82.55
  pour Bottom (no thermals): 216.58,65.79 216.07,67.14 216.07,77.72 215.98,80.01 216.32,82.13 215.73,82.63 214.71,80.09 214.04,77.39 213.87,76.12 213.87,67.31 213.7,65.53
  pour Bottom (isolate 0.254, no thermals): 215.73,82.63 219.37,87.63 219.63,88.31 219.63,90 218.61,91.1 212.01,91.1 211.24,90.76 210.48,89.66 210.48,88.14 210.14,87.21 209.63,86.53 209.21,86.02 202.95,83.57 201.76,83.74 194.9,86.87 191.69,87.97 193.29,90.17 201.17,84.92 202.27,84.67 203.12,84.75 209.04,86.95 209.63,88.31 209.63,89.58 209.97,90.59 210.65,91.27 211.24,91.61 212.34,91.86 218.86,91.86 220.22,90.59 220.39,90.09 220.39,88.05 219.96,87.12 216.32,82.13
!CRUN  (via drill 0.81 pad 3.22)
  other vias: 137.67,70.78
  pour Bottom (no thermals): 136.14,70.78 136.57,75.1 136.4,76.28 135.81,77.47 134.54,78.4 132.93,78.57 118.87,78.57 117.77,78.91 116.42,79.42 102.45,86.7 103.12,87.55 117.6,79.84 119.46,79.42 133.35,79.42 134.54,79.33 135.81,78.91 136.91,77.98 137.67,75.78 139.28,70.87
  pour Bottom (no thermals): 103.12,87.55 102.02,88.98 101.09,90.51 99.06,88.56 102.45,86.7
!CRUN_CMD
  pour Bottom (no thermals): 45.38,74.68 43.43,77.22 42.33,78.4 28.7,82.38 19.3,82.38 19.3,83.06 29.21,83.14 42.42,79.25 44.7,78.23 47.24,77.39
  pour Bottom (no thermals): 19.3,83.06 18.2,82.97 17.19,82.47 15.66,80.86 12.53,76.88 8.89,72.64 6.35,70.27 4.74,68.66 7.11,67.06 9.4,71.29 10.33,72.98 13.46,76.88 16.51,80.69 17.78,82.04 18.71,82.47 19.3,82.38
!CTAD
  pour Bottom (no thermals): 184.15,75.61 168.57,85.85 167.22,86.7 165.44,88.05 163.91,90.17 161.71,88.31 163.58,86.53 165.35,86.28 166.54,85.94 167.81,85.34 183.64,74.93
  pour Bottom (no thermals): 193.04,33.19 192.7,36.32 192.7,41.57 193.04,43.1 193.12,44.37 192.79,46.06 192.79,51.39 192.96,54.1 192.96,55.37 192.53,56.22 192.53,62.99 192.7,63.75 192.96,65.62 192.7,66.46 192.7,69.26 192.53,70.36 191.94,71.12 188.13,73.66 184.15,75.61 183.64,74.93 187.54,72.98 189.48,71.63 190.16,70.78 190.16,67.56 189.74,66.04 189.65,64.94 189.99,63.67 189.99,57.57 189.82,56.56 189.57,54.44 189.82,53.34 191.18,50.97 191.43,49.78 191.43,48.34 190.92,46.82 190.08,44.96 189.91,43.52 190.84,40.89 191.35,39.12 191.43,38.44 191.26,37.68 189.82,33.19
!DEFER
  pour Bottom (no thermals): 219.88,191.43 219.79,190.84 219.2,190.08 218.78,189.4 218.78,187.88 219.29,187.28 219.29,186.01 217.25,186.01 217.51,187.28 218.02,187.88 218.02,189.4 217.42,190.67 217.34,191.26 217.34,191.43
!DEP_EX
  pour Bottom (no thermals): 259.42,185.17 260.1,185 262.64,185 263.23,185.25 263.48,185.93 263.48,186.86 263.4,187.71 261.7,191.6 259.33,191.6 259.08,186.01
!DEPOSIT  (via drill 0.81 pad 2.03)
  Top 0.813: v230.72,153.59 v245.87,153.59
  pour Bottom (no thermals): 231.82,150.54 231.82,153.67 229.7,153.67 229.79,150.54
  pour Bottom (no thermals): 246.13,152.57 246.8,152.91 247.23,153.59 247.65,154.6 248.24,155.45 248.67,156.21 248.67,166.96 248.84,167.64 249.34,168.23 250.11,168.66 253.24,168.66 254.42,168.74 255.61,169.67 255.95,170.35 256.03,171.2 256.12,173.99 255.95,174.84 255.52,175.6 254.93,175.94 254.17,176.19 253.32,176.36 253.41,178.31 252.81,179.49 252.9,180.51 254,181.53 273.39,181.53 274.15,181.27 275.34,180.51 276.01,180.51 276.01,183.05 275.42,183.05 274.57,182.54 273.22,182.03 253.83,182.03 252.14,180.68 252.14,179.49 251.38,178.31 251.54,177.29 252.48,176.02 253.92,175.68 254.68,175.43 255.27,174.92 255.52,173.91 255.44,170.77 255.19,170.1 254.34,169.33 250.7,169.33 249.77,169.25 249.09,168.74 248.41,168.15 247.99,167.3 247.99,157.73 247.82,156.13 247.06,155.28 246.38,154.86 245.53,154.6 245.03,154.18
!EXEC
  pour Bottom (no thermals): 209.55,191.43 209.97,190.42 210.65,189.99 211.75,188.64 212.09,188.04 213.11,186.1 213.78,184.66 214.55,184.07 215.65,183.64 217.42,183.56 219.54,183.13 221.23,182.63 223.44,181.53 224.45,180.93 224.96,180.17 224.87,178.39 226.91,178.39 226.74,179.75 226.23,180.26 225.38,181.02 224.28,181.95 222.76,182.54 221.32,183.3 219.37,183.81 216.83,184.23 215.39,184.4 214.55,184.91 214.12,185.67 213.36,187.2 212.34,189.06 211.92,190.58 212.09,191.43 211.92,192.28
!EXT_DEP
  pour Bottom (no thermals): 219.96,150.28 219.63,150.54 219.88,157.4 219.2,158.16 217.51,158.41 217,158.67 216.92,159.51 217.51,160.36 218.19,160.53 224.37,160.53 224.96,159.85 224.96,158.83 224.37,158.33 222.67,158.24 221.66,157.14 221.66,150.54
!EXT_LA  (via drill 0.81 pad 2.03)
  Top 0.813: v235.46,109.98 v235.46,127.76
  pour Bottom (no thermals): 138.18,128.02 138.43,128.44 139.02,128.78 143.26,128.61 144.19,128.95 145.03,129.62 145.63,130.22 146.39,130.3 158.58,130.3 159.6,130.05 160.19,129.46 160.61,128.86 160.61,126.24 160.95,124.97 161.63,124.21 161.88,123.11 158.75,122.94 158.75,123.87 159,124.54 159.85,125.31 159.94,126.49 159.94,128.69 159.43,129.29 158.75,129.62 146.39,129.62 145.63,129.2 144.86,128.35 144.86,126.83 145.2,126.15 146.05,125.39 148.25,124.38 150.03,123.36 151.21,122.34 151.72,121.58 152.4,120.4 152.99,118.96 153.5,117.6 153.67,116.67 154.09,114.3 154.43,112.18 155.02,110.91 155.7,109.9 156.55,108.88 157.82,108.37 159.09,107.95 160.95,107.95 162.14,108.2 203.03,108.2 204.3,108.37 205.32,109.14 206.25,109.73 207.43,110.15 208.79,110.49 232.66,110.32 234.27,110.49 234.7,110.57 234.95,111 236.22,109.22 235.8,108.97 235.12,108.97 234.61,109.3 233.26,109.22 232.75,108.63 232.66,108.03 232.33,107.36 231.56,107.19 230.89,107.19 230.21,107.78 229.95,108.63 229.19,109.47 228.26,109.73 209.04,109.81 207.86,109.64 206.84,109.22 205.74,108.54 204.98,107.95 204.22,107.61 203.03,107.53 162.22,107.53 161.21,107.36 159.94,107.19 158.41,107.44 156.97,107.95 156.04,108.63 154.43,110.57 153.84,111.93 153.5,113.62 152.99,117.01 152.48,118.62 151.55,120.65 150.71,121.92 149.44,123.02 145.88,124.8 144.7,125.48 143.76,126.32 143,126.66 139.53,126.49 138.77,126.58 138.35,127.08 138.18,127.76
  pour Bottom (no thermals): 158.75,122.94 159.26,122.17 160.19,121.75 161.21,122.09 161.88,123.11
  pour Bottom (no thermals): 259.33,133.27 257.22,131.83 255.27,130.47 253.41,129.2 251.54,127.42 250.11,126.07 249.34,125.98 248.33,126.07 236.81,128.02 236.39,128.69 235.71,128.78 235.12,128.78 235.12,126.66 236.05,126.75 236.98,127.25 248.24,125.48 249.68,125.39 250.27,125.56 253.24,128.1 255.69,130.13 256.88,130.89 258.66,132 260.35,133.18 261.37,133.6 263.31,133.6 263.57,133.86 263.57,135.38 263.23,135.89 259.67,135.89 259.42,135.38 259.42,133.94
!FETCH
  pour Bottom (no thermals): 224.37,186.01 224.28,187.45 223.69,188.04 223.69,189.48 224.11,190.16 224.71,191.01 224.71,191.43 222.17,191.43 222.17,191.01 222.5,190.33 222.93,189.57 222.93,188.04 222.5,187.37 222.33,186.01
!FLAG-ID0
  pour Bottom (no thermals): 237.49,22.18 239.78,15.83 240.37,14.73 241.47,14.05 242.74,13.8 244.43,13.72 244.26,14.48 242.82,14.73 241.64,15.07 241.05,15.58 240.62,16.59 240.54,22.44
  pour Bottom (no thermals): 244.26,14.48 247.06,14.22 249.77,14.05 250.78,13.97 252.9,13.04 255.61,12.53 254,10.24 252.31,12.36 251.29,12.87 250.44,13.21 247.65,13.38 244.43,13.72
!FLAG-ID1
  pour Bottom (no thermals): 229.28,10.92 230.8,10.33 232.33,9.99 236.05,9.06 237.24,8.47 238.17,7.37 238.68,5.76 240.96,7.37 239.18,8.3 237.74,8.97 236.73,9.48 235.2,9.82 233.34,10.24 231.48,10.75 229.36,11.6
  pour Bottom (no thermals): 221.57,21.93 222.67,20.07 223.18,19.05 223.52,17.78 223.86,14.82 224.28,13.97 225.81,12.87 227.41,11.85 228.35,11.43 229.28,10.92 229.36,11.6 228.52,12.02 227.67,12.53 226.31,13.38 225.47,14.05 224.96,14.82 224.79,17.1 224.79,21.51 224.71,22.35
!FLAG-OD0
  pour Bottom (no thermals): 205.66,22.44 206.25,14.56 206.84,12.7 207.94,11.77 211.24,10.33 211.58,11.18 209.47,12.11 208.45,13.21 208.2,14.9 208.11,16 208.28,18.03 208.87,22.27
  pour Bottom (no thermals): 211.58,11.18 213.19,10.41 215.05,9.31 217.34,7.87 218.27,6.94 215.73,5.5 215.31,6.43 215.14,7.28 214.71,8.04 213.78,8.81 212.43,9.74 211.24,10.33
!FLAG-OD1
  pour Bottom (no thermals): 189.82,22.35 191.69,13.63 192.19,11.85 196.17,8.47 196.85,9.14 193.04,12.45 192.62,14.99 192.7,16.85 193.04,22.44
  pour Bottom (no thermals): 196.85,9.14 199.47,7.87 200.32,7.03 197.87,5.59 197.44,7.28 196.17,8.47
!HLT
  pour Bottom (no thermals): 275.51,114.55 275.51,117.09 275.34,117.09 274.83,116.84 274.57,116.5 273.64,116.5 273.22,116.92 272.63,117.6 272.46,118.36 272.46,125.48 272.12,126.32 271.53,126.92 271.19,127.59 271.19,133.6 271.44,135.13 271.19,136.4 270.76,136.99 269.83,136.99 269.58,136.4 269.49,134.87 270.43,133.6 270.43,127.42 270.59,127.08 271.27,126.24 271.78,125.39 271.78,118.03 271.95,117.35 273.98,115.15 274.74,114.72
!LA1
  pour Bottom (no thermals): 268.9,142.75 268.73,143.51 268.14,144.19 271.7,147.4 272.88,148.42 275.08,150.45 276.1,151.38 276.69,152.4 276.94,153.25 276.52,153.84 274.49,153.75 274.57,152.91 275.17,152.06 275,151.21 273.81,150.11 271.78,148.42 267.38,144.27 267.04,143.43 266.87,142.75
!RESET-ID0
  pour Bottom (no thermals): 253.24,14.9 256.12,13.97 259.59,12.95 261.2,12.36 259.42,10.16 256.88,12.62 255.78,13.29 253.15,14.05
  pour Bottom (no thermals): 243.92,18.54 246.3,16.85 248.84,16.09 251.21,15.58 253.24,14.9 253.15,14.05 251.21,14.65 248.92,14.99 242.74,15.66
!RESET-ID1
  pour Bottom (no thermals): 231.73,11.85 236.81,10.41 239.95,9.48 241.38,9.06 242.32,8.72 245.62,7.54 243.67,5.5 241.47,7.96 240.54,8.38 238.17,9.4 236.64,9.91 231.48,11.26
  pour Bottom (no thermals): 228.52,18.12 229.02,16.76 229.53,13.97 230.12,13.12 230.97,12.28 231.73,11.85 231.48,11.26 230.72,11.51 229.28,12.45 228.77,12.87 228.01,13.63 226.23,15.83 225.81,16.43
!RESET-OD0
  pour Bottom (no thermals): 212.85,17.27 212.77,16.17 212.77,14.56 212.68,13.29 212.94,12.19 220.05,8.3 222.08,7.37 219.71,5.76 219.03,7.7 216.32,9.31 210.4,12.45 209.63,14.14 209.63,17.27
!RESET-OD1
  pour Bottom (no thermals): 197.02,17.27 196.85,13.63 197.1,11.85 197.7,10.92 198.8,10.24 197.78,9.48 195.16,11.51 194.39,13.12 193.8,17.27
  pour Bottom (no thermals): 198.8,10.24 202.52,8.38 203.88,7.7 204.55,6.86 201.93,5.67 201.17,7.62 200.66,8.13 199.64,8.64 197.78,9.48
!RUN
  pour Bottom (no thermals): 229.45,186.01 229.45,187.37 228.68,188.3 228.68,189.4 229.28,190.25 229.53,190.84 229.7,191.35 227.16,191.35 227.16,190.75 227.58,190.25 228.01,189.31 228.01,188.13 227.41,187.37 227.41,186.01
!RUN_CMD
  pour Bottom (no thermals): 276.52,165.44 276.35,167.56 276.52,168.23 276.94,168.74 274.66,169.84 274.4,169.08 274.4,167.47 274.49,165.44
+5V
  pour Bottom (no thermals): 25.06,6.77 23.71,6.77 21.08,7.28 19.56,8.38 15.16,13.97 12.7,19.13 11.68,28.02 11.68,42.33 12.19,44.11 13.55,45.21 14.99,45.8 16.43,45.89 17.86,45.38 19.13,44.62 19.81,43.26 19.81,19.56 20.49,17.1 21.84,15.49 23.54,14.73 25.06,14.48
  pour Bottom (no thermals): 27.18,79.42 36.75,72.22 37.51,71.2 37.08,65.28 37.51,60.37 37.08,54.44 37.59,49.78 37.08,43.94 37.59,38.52 37.08,33.19 37.68,28.02 37.08,22.35 37.59,16.59 37.34,15.83 36.41,14.82 35.14,14.48 25.06,14.48 25.06,6.77 93.05,6.77 118.79,9.4 118.79,12.19 106,12.36 93.81,9.14 90.76,8.38 86.61,8.47 84.5,8.55 71.71,11.77 70.1,12.28 53.85,12.28 52.83,11.85 52.24,11.09 51.65,9.82 50.29,8.38 43.6,8.38 42.76,8.55 41.91,9.14 41.32,10.24 41.49,11.26 42.33,12.36 43.6,13.72 44.28,14.9 44.37,16.34 44.2,17.78 44.03,21.51 44.03,23.62 44.11,25.23 44.53,27.77 44.45,28.7 44.03,32 44.11,36.41 44.28,37.85 44.28,39.12 43.94,43.77 44.37,44.7 44.7,46.23 44.2,49.61 43.86,50.46 43.18,51.14 42.33,55.12 42.25,56.39 41.74,57.32 40.3,58.59 40.05,59.01 40.13,60.11 41.49,64.18 41.66,64.85 41.57,65.62 40.22,69.68 40.22,72.05 40.3,74.59 40.56,75.78 40.47,76.62 39.79,77.3 28.11,81.11
  cutout Bottom (no thermals): 15.58,32 16.17,32 16.17,29.46 15.58,29.46
  cutout Bottom (no thermals): 15.58,32 16.17,32 16.17,29.46 15.58,29.46
AC0
  pour Bottom (no thermals): 2.12,115.91 2.12,118.28 2.71,118.11 3.56,117.86 4.57,118.03 6.35,119.72 7.54,121.24 8.38,123.11 9.65,125.65 10.5,126.32 11.6,126.66 46.31,129.79 47.16,129.96 47.58,130.73 47.33,131.83 47.33,132.67 49.19,132.76 49.19,131.49 48.51,130.56 47.41,129.46 46.57,129.12 11.26,125.98 10.41,125.39 9.74,124.54 8.04,121.07 7.2,119.8 4.4,117.18 3.64,116.84 2.79,115.99
AC1
  pour Bottom (no thermals): 2.46,119.13 3.47,119.63 4.66,120.31 5.76,121.07 6.77,121.92 7.54,123.11 8.04,124.38 8.97,125.9 9.82,126.83 10.84,127.42 41.66,130.13 42.76,130.64 43.69,131.32 44.11,131.83 44.11,132.84 42.08,132.84 42.08,131.83 41.91,131.06 41.15,130.73 10.58,128.1 9.57,127.59 8.72,126.83 8.04,125.73 6.94,123.44 5.67,121.92 4.66,121.16 3.64,120.99 2.79,121.33 2.03,121.41 2.03,119.13
AC2
  pour Bottom (no thermals): 2.88,122.34 5.16,123.95 7.11,125.98 7.87,127.08 8.72,127.93 10.08,128.69 38.44,131.06 38.95,131.66 39.03,132.59 37,132.59 36.91,131.91 36.49,131.49 10.41,129.37 8.72,128.78 7.11,127.25 6.77,126.32 4.91,124.54 4.06,124.38 3.13,124.38 2.62,124.71 1.95,124.63 1.95,122.17
AC3
  pour Bottom (no thermals): 2.29,125.39 2.88,125.65 5.25,127.51 8.3,129.2 10.16,130.05 36.91,135.47 39.2,135.81 42.59,136.14 45.55,136.65 47.58,137.33 49.11,138.01 50.29,138.26 51.14,138.51 51.65,139.11 51.65,140.46 49.78,140.46 49.78,139.78 49.53,138.94 48.01,138.01 44.87,137.08 41.83,136.65 38.44,136.31 34.97,135.72 9.91,130.64 8.04,129.79 6.69,128.95 4.66,127.93 3.47,127.59 2.62,127.76 2.03,127.76 2.03,125.39
AC4
  pour Bottom (no thermals): 2.03,128.52 2.46,128.61 4.32,129.79 7.11,130.81 33.36,136.4 37.42,136.82 40.56,137.08 43.43,137.75 45.04,138.35 46.14,139.11 46.48,139.53 46.48,140.55 44.87,140.55 44.87,139.95 44.37,139.02 43.6,138.35 41.06,137.75 33.27,136.99 7.2,131.57 4.83,130.73 3.3,130.73 1.86,130.98 1.95,128.52
AC5
  pour Bottom (no thermals): 2.03,131.74 2.03,134.11 2.54,134.03 3.13,133.6 5.84,133.52 9.91,133.6 11.85,133.94 32.6,138.35 34.12,138.68 38.78,138.85 39.29,139.02 39.54,139.62 39.54,140.21 41.57,140.21 41.49,139.36 40.89,138.6 39.2,138.26 35.98,138.09 33.87,137.92 10.58,133.01 4.15,132.84 3.47,132.25 2.62,131.83 2.2,131.66
AC6
  pour Bottom (no thermals): 2.03,134.79 2.03,137.33 2.62,137.24 3.47,136.57 4.66,136.23 6.52,136.06 8.21,135.47 9.82,135.04 11.43,135.13 12.95,135.38 14.48,136.48 16.09,137.67 17.53,138.01 18.71,139.02 18.97,140.38 18.97,143.43 18.37,144.1 18.37,145.71 19.22,145.63 19.56,145.12 19.56,139.7 19.22,138.6 17.7,137.33 16.26,136.99 14.05,135.38 13.12,134.79 11.26,134.37 9.14,134.54 7.54,134.96 6.01,135.47 4.49,135.55 3.56,135.47 2.88,134.96
AC7
  pour Bottom (no thermals): 2.03,138.09 2.03,140.46 2.62,140.38 3.3,139.87 5.08,139.02 6.1,138.43 6.94,137.75 7.7,137.08 9.99,136.31 11.68,136.4 12.95,136.91 14.48,137.92 15.49,139.36 16,141.31 16,149.44 17.44,150.88 18.54,150.88 18.54,149.01 16.76,149.01 16.68,147.83 16.68,141.39 16.34,140.04 15.83,138.77 14.73,137.33 13.29,136.31 11.6,135.81 9.91,135.72 8.21,136.31 7.54,136.4 5.93,137.75 4.91,138.26 3.89,138.43 2.46,138.01
AND
  pour Bottom (no thermals): 204.55,192.28 205.06,191.6 205.49,191.09 206.5,189.91 208.7,188.3 210.4,186.94 212.34,185.08 214.04,183.56 215.39,182.96 217.34,182.46 218.95,181.86 220.64,180.85 221.66,179.66 221.83,178.73 221.83,178.14 219.88,178.14 219.88,180.09 219.54,180.76 218.69,181.27 217.09,181.86 215.22,182.46 213.87,182.88 213.02,183.56 211.58,184.83 209.97,186.52 208.53,187.62 207.01,188.81 205.57,189.82 204.55,190.25 203.45,190.25 202.61,190.67 202.61,191.85
CAC0
  pour Bottom (no thermals): 220.81,28.28 220.73,27.01 220.47,22.86 220.56,21.59 220.9,20.57 221.74,19.47 222.33,18.37 222.76,17.02 223.1,14.65 223.52,13.63 227.33,11.35 230.46,9.91 230.04,9.4 226.91,10.84 223.35,12.7 222.59,13.38 222.17,14.39 221.74,17.19 221.23,18.29 220.73,18.88 219.96,20.32 219.54,21.59 219.46,22.94 219.03,24.05 217.68,27.6
  pour Bottom (no thermals): 230.46,9.91 233.09,9.23 234.53,8.97 236.22,8.47 236.9,7.96 237.66,6.94 237.74,5.93 238,4.83 238.59,4.23 239.61,3.89 249.6,3.98 251.12,4.23 267.29,7.62 267.89,8.21 269.66,10.24 270.59,11.18 275.17,14.73 276.1,16 276.69,17.36 278.38,15.58 275.51,13.72 270.59,10.24 268.39,7.62 267.8,7.2 267.04,6.77 251.46,3.47 249.85,3.22 239.61,3.22 238.59,3.39 237.32,4.57 237.15,5.16 237.07,6.77 236.3,7.79 235.54,8.21 233.51,8.55 231.9,8.81 230.04,9.4
CAC1
  pour Bottom (no thermals): 221.57,33.02 223.35,27.01 223.86,26.08 224.79,25.15 225.98,24.72 228.26,24.47 229.95,24.38 231.06,24.47 231.9,24.3 232.66,23.71 233.26,22.86 233.34,21.42 233.17,20.66 232.49,19.22 231.82,18.12 231.65,16.93 231.9,15.24 232.41,14.05 233,13.29 234.36,12.78 234.61,13.46 233.34,14.14 232.75,15.24 232.58,16.59 232.58,17.53 233,18.29 233.85,19.73 234.19,21 234.1,22.61 233.34,23.96 232.24,24.81 231.31,25.06 229.53,25.06 228.01,25.32 226.31,25.65 225.04,26.33 224.54,27.6 224.54,31.5 224.79,33.1
  pour Bottom (no thermals): 234.61,13.46 238.17,12.11 239.1,11.94 242.4,11.94 244.01,11.85 245.45,11.51 246.72,10.92 247.99,10.16 249.26,9.31 250.53,8.97 266.36,8.97 267.38,9.82 268.39,11.77 275.84,19.22 276.61,20.49 277.96,18.54 276.18,18.46 275.34,17.7 268.82,11.26 268.31,9.91 267.29,8.55 266.19,8.21 250.87,8.21 249.77,8.47 248.24,8.89 247.23,9.65 245.96,10.5 244.94,10.92 243.33,11.18 241.05,11.26 238.93,11.35 238.17,11.51 234.36,12.78
CAC2
  pour Bottom (no thermals): 225.98,27.01 226.74,26.5 229.28,25.99 230.63,25.74 231.48,25.57 232.58,25.23 234.02,23.96 234.95,23.79 236.3,23.79 237.15,24.05 238.17,24.47 239.1,24.47 239.86,24.3 240.88,23.54 241.3,23.11 242.4,22.69 243.59,22.69 244.26,22.86 245.11,23.62 245.7,24.13 246.3,24.38 247.14,24.47 248.24,24.21 248.75,23.88 249.43,23.79 258.91,23.79 258.91,24.55 249.09,24.55 248.33,24.72 248.16,24.81 247.31,25.06 246.38,25.06 245.53,24.72 244.52,23.79 243.92,23.28 243.16,23.28 242.15,23.45 241.64,23.71 240.71,24.38 240.11,24.81 239.27,25.15 238.34,25.15 237.57,24.98 236.64,24.64 235.54,24.47 235.03,24.47 234.19,24.64 233,25.65 231.9,26.08 230.97,26.67 228.18,29.38
  pour Bottom (no thermals): 258.91,23.79 275.84,22.27 277.03,21.84 276.94,24.05 275.76,23.45 258.91,24.55
CAC3
  pour Bottom (no thermals): 232.66,33.19 232.58,29.04 232.58,28.02 232.92,27.18 233.68,26.5 234.44,25.91 235.63,25.82 236.39,25.99 237.32,26.16 238.17,26.25 239.18,26.42 240.03,26.16 240.88,25.57 241.55,25.06 242.49,24.64 243.25,24.55 243.84,24.81 244.6,25.32 245.28,25.91 246.04,26.16 246.89,26.42 249.51,25.99 258.83,25.91 258.83,25.15 249.26,25.15 247.23,25.65 246.72,25.65 246.04,25.48 245.19,25.06 244.18,24.21 243.42,23.88 242.49,23.88 241.55,24.38 240.96,24.81 240.2,25.32 239.52,25.65 238.76,25.74 238,25.57 237.32,25.48 236.3,25.32 235.54,25.23 234.78,25.23 234.1,25.4 233.26,26.08 232.07,26.75 231.48,27.43 229.62,32.6
  pour Bottom (no thermals): 258.83,25.91 276.01,26.84 277.03,27.43 277.2,25.32 275.93,25.57 258.83,25.15
CAC4
  pour Bottom (no thermals): 234.95,26.5 236.56,26.67 237.49,26.92 238.34,27.01 239.01,27.09 239.86,26.92 240.62,26.33 241.47,25.74 242.4,25.15 243.08,25.15 243.67,25.32 244.94,26.25 245.96,26.84 247.23,27.6 248.07,28.19 249,28.96 249.85,29.63 250.7,30.23 251.29,30.9 251.63,31.83 251.88,32.94 252.56,33.87 253.66,34.71 254.76,34.97 258.4,34.97 258.57,35.64 254.34,35.64 253.32,35.48 252.65,34.97 251.71,33.95 251.29,33.19 250.87,32.17 250.53,31.16 250.19,30.73 249.43,30.31 248.84,29.72 247.4,28.62 246.55,28.02 245.79,27.52 244.86,26.84 243.5,25.91 242.57,25.82 241.55,26.33 241.05,26.84 240.45,27.6 239.52,28.11 235.29,29.63
  pour Bottom (no thermals): 258.4,34.97 275.93,29.55 276.69,28.62 277.28,30.56 276.27,30.73 258.57,35.64
CAC5
  pour Bottom (no thermals): 238.08,34.54 239.44,35.14 243.42,36.15 244.35,36.66 245.62,38.1 251.04,45.97 251.8,46.65 252.98,47.33 253.83,47.58 257.3,47.58 257.3,46.91 254.51,46.91 253.58,46.74 252.56,46.23 251.8,45.55 245.19,36.66 244.69,35.98 243.76,35.22 239.95,31.92
  pour Bottom (no thermals): 257.3,46.91 258.06,46.91 259.42,46.74 260.43,46.31 266.87,39.88 267.8,39.71 268.73,39.71 277.54,41.06 278.21,40.98 279.23,40.47 279.74,39.71 279.74,36.07 279.65,35.48 279.4,34.71 278.47,34.04 277.54,33.87 278.64,32.09 279.06,33.02 280.08,34.37 280.42,35.31 280.42,39.62 280.33,40.13 279.74,40.89 278.55,41.74 277.62,41.83 276.27,41.57 268.31,40.3 267.29,40.56 262.21,45.64 260.43,46.99 259.5,47.5 257.3,47.58
CAC6
  pour Bottom (no thermals): 243.5,26.67 248.07,29.8 249.34,30.99 250.02,31.67 250.44,32.85 250.95,34.46 251.21,35.31 251.88,35.98 252.98,36.32 258.49,36.32 258.49,37.08 252.39,37.08 251.63,36.83 250.53,35.9 250.19,35.05 249.6,33.1 249.34,32 248.33,31.16 242.74,29.63
  pour Bottom (no thermals): 258.49,37.08 276.18,36.66 277.45,37.17 276.86,34.97 275.93,35.56 258.49,36.32
CAC7
  pour Bottom (no thermals): 213.7,43.6 214.63,41.4 215.9,37.68 216.24,37 217.09,36.15 218.02,35.81 219.03,35.64 220.56,35.73 222.67,35.73 223.69,35.64 224.37,35.14 225.38,34.63 226.31,34.29 227.41,34.37 228.09,34.46 228.77,34.88 229.7,35.31 230.55,35.48 231.82,35.31 233.17,34.46 234.1,33.36 236.98,30.73 238.17,30.31 239.01,30.14 240.28,30.48 242.65,31.16 246.89,31.67 248.24,32.26 250.78,40.81 251.38,42.16 252.14,43.26 252.73,44.28 253.83,44.96 254.76,45.38 256.03,45.64 257.3,45.64 257.3,46.4 255.61,46.4 254.51,46.14 253.32,45.64 252.31,45.04 251.54,43.86 250.7,42.67 246.8,37.59 245.36,35.73 240.79,31.75 239.86,31.07 239.1,30.9 238.08,31.07 237.32,31.5 233.85,34.63 232.83,35.31 231.99,35.81 231.06,35.98 230.04,35.98 229.02,35.73 228.43,35.31 227.16,35.05 225.98,34.97 225.13,35.39 224.37,36.07 223.01,36.49 221.91,36.58 219.63,36.41 218.19,36.41 217.17,37.08 216.66,37.85 216.49,38.95 216.75,44.03
  pour Bottom (no thermals): 257.3,46.4 258.06,46.31 259.25,45.89 260.35,45.3 265.6,39.79 266.36,39.2 267.55,38.69 269.07,38.78 275.84,39.37 276.78,39.88 277.11,37.93 276.1,38.27 267.97,38.02 266.62,38.27 265.43,38.95 264.24,40.13 260.01,44.53 259,45.3 258.15,45.55 257.3,45.64
CCLOCK_RATE